# Altium schematic sheet isolation.SchDoc
size A4; SheetNumber: 3; SheetTotal: 8
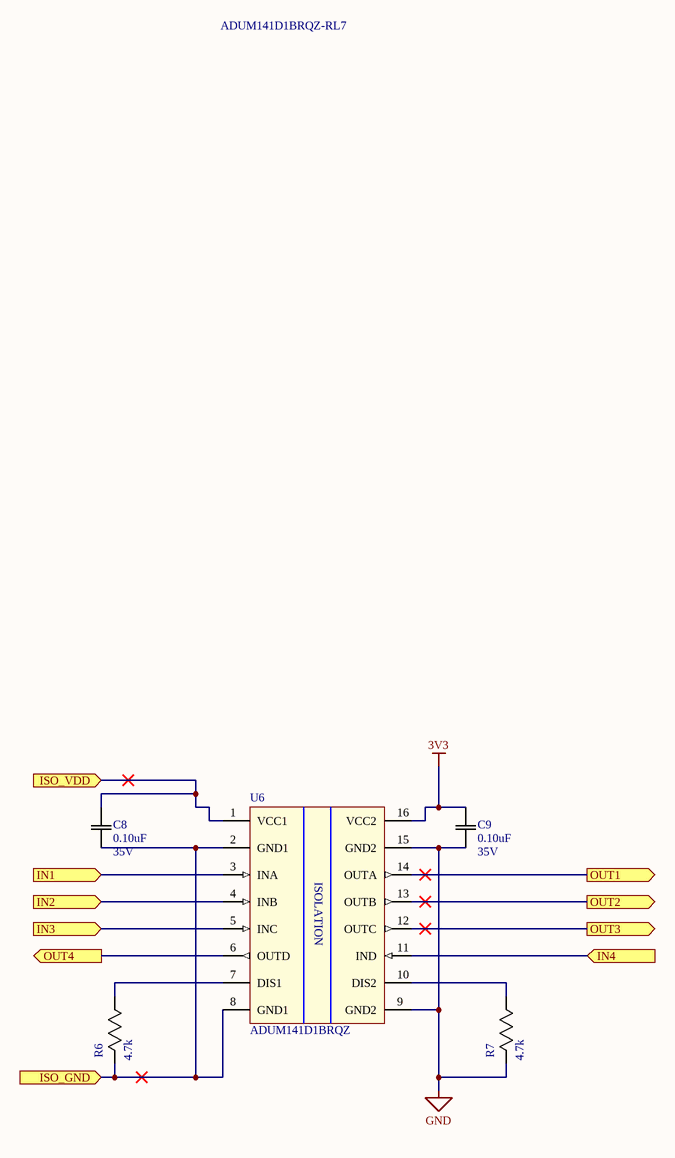
[diagram p0: isolation.SchDoc]

## Parts
C8  Rating: 35V  [0603]  (hidden comment: 0.10uF)
C9  Rating: 35V  [0603]  (hidden comment: 0.10uF)
R6  4.7k  [0603]
R7  4.7k  [0603]
U6  ADUM141D1BRQZ  Supplier Part Number 1: ADUM141D1BRQZ-RL7  [SOP64P600X175-16N]

## Ports
IN1 (in), IN2 (in), IN3 (in), IN4 (in), ISO_GND (in), ISO_VDD (in), OUT1 (out), OUT2 (out), OUT3 (out), OUT4 (out)

## Nets
3V3: C9.2(C2) U6.16(VCC2)
GND: C9.1(C1) R7.2(R2) U6.9(GND2) U6.15(GND2)
IN1: U6.3(INA) ; port IN1
IN2: U6.4(INB) ; port IN2
IN3: U6.5(INC) ; port IN3
IN4: U6.11(IND) ; port IN4
ISO_GND: C8.1(C1) R6.2(R2) U6.2(GND1) U6.8(GND1) ; port ISO_GND
ISO_VDD: C8.2(C2) U6.1(VCC1) ; port ISO_VDD
OUT1: U6.14(OUTA) ; port OUT1
OUT2: U6.13(OUTB) ; port OUT2
OUT3: U6.12(OUTC) ; port OUT3
OUT4: U6.6(OUTD) ; port OUT4
NetR6_1: R6.1(R1) U6.7(DIS1)
NetR7_1: R7.1(R1) U6.10(DIS2)

## Notes on the sheet
- (in symbol ISO ADUM141D1BRQZ) ISOLATION

## Library data of the parts
C8 C9 = CAP 0.10uF 35V: CAP CER 0.10UF 35V X7R 0603/0805; Tolerance: 10%; Package: 0603/0805; Temperature Coefficient: X7R; Operating Temperature: -55°C ~ 125°C; Value: 0.10uF
R6 R7 = RES 4.7k 1/8W - 5%: RES SMD 4.7k OHM 5% 1/8W 0805; Power (Watts): 0.125W; Package: 0805; Value: 4.7k; Tolerance: 5%
U6 = ISO ADUM141D1BRQZ: Digital Isolator CMOS 4-CH 150Mbps 16-Pin QSOP T/R; Manufacturer: Analog Devices; Isolated Power: No; Number of Channels: 4; Channel Type: Unidirectional; Propagation Delay: 13ns; Pulse Width Distortion (PWD): 3ns; Supplier 1: Arrow Electronics; Manufacturer Part Number: ADUM141D1BRQZ-RL7; RoHS: Yes; Category: Interface ICs; Stock 1: 341; Pricing 1: 1=3.87700, 10=3.47000, 25=3.26100, 50=3.22900, 100=2.78500, 250=2.67500 (USD); Mount: Surface Mount; Case/Package: SSOP; Number of Pins: 16; Min Operating Temperature: -40°C; Max Operating Temperature: 125°C; Type: General Purpose; Packaging: Tape and Reel; Data Rate: 150Mbps; RoHS Compliant: Yes; ComponentLink1URL: https://www.analog.com/media/en/technical-documentation/data-sheets/ADuM140D_140E_141D_141E_142D_142E.pdf?src-supplier=Digi-Key; ComponentLink1Description: https://www.analog.com/media/en/technical-documentation/data-sheets/ADuM140D_140E_141D_141E_142D_142E.pdf?src-supplier=Digi-Key